# Altium schematic sheet Interface_Accelerometer_1.SchDoc
size A4
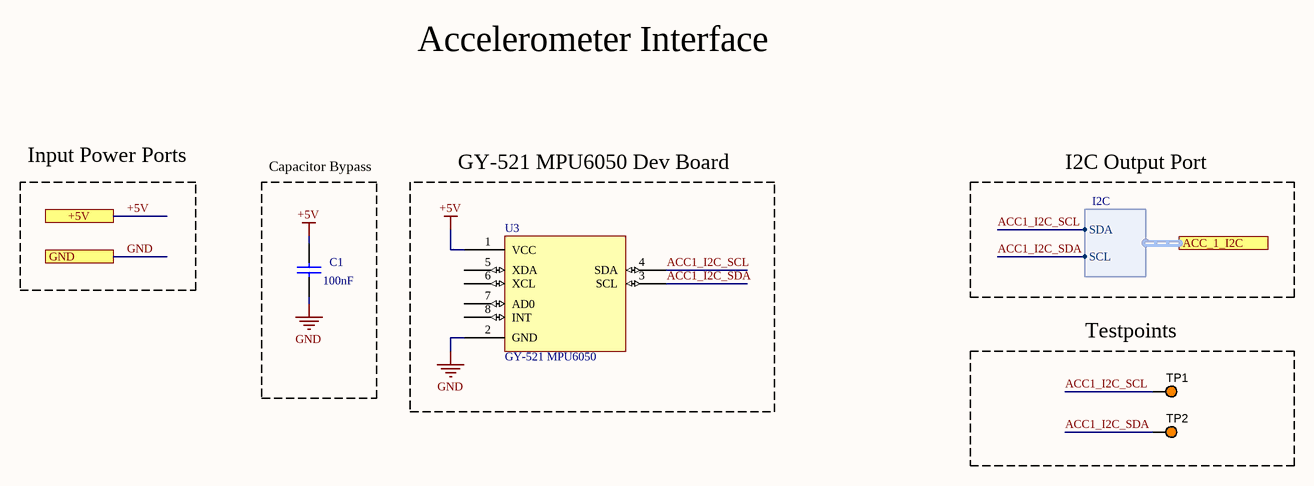
[diagram p0: Interface_Accelerometer_1.SchDoc]

## Parts
C1  100nF  [CAP200]
TP1  5003  [KSTN-5003]  (value not drawn)
TP2  5003  [KSTN-5003]  (value not drawn)
U3  GY-521 MPU6050  [GY-521 MPU6050]

## Blocks framed on the sheet
Capacitor Bypass: C1
GY-521 MPU6050 Dev Board: U3
Testpoints: TP1 TP2

## Ports
+5V, ACC_1_I2C (harness I2C), GND

## Harnesses
I2C: SDA, SCL

## Nets
+5V: C1.1 U3.1(VCC) ; port +5V
GND: C1.2 U3.2(GND) ; port GND
ACC1_I2C_SCL: TP1.1 U3.4(SDA) ; port ACC_1_I2C.SDA
ACC1_I2C_SDA: TP2.1 U3.3(SCL) ; port ACC_1_I2C.SCL

Not connected (* = marked no-connect by the designer): U3 5(XDA) 6(XCL) 7(AD0) 8(INT)

## Notes on the sheet
- Accelerometer Interface
- Input Power Ports
- I2C Output Port

## Library data of the parts
C1 = CAP
TP1 TP2 = CMP-002-00037-2: Test Point, Orange, Height 4.6 mm, Tail Length 3 mm, 1-Pin THD, RoHS; Manufacturer: Keystone; Colour: Orange; Packaging: Bulk; Package Description: 1-Pin Through Hole Device, Dia 2.54 mm; Pins: 1; Package Reference: 5003; Datasheet Version: Jun-15; Case/Package: 5003; Mounting Technology: TH; Connector Type: TestPoint; Diameter: 2.54mm; Contact Material: Bronze; Datasheet URL: http://keyelco.com/userAssets/file/M65p56.pdf; Manufacturer URL: http://www.keyelco.com/; Package Quantity: 10; Contact Plating: Tin; RoHS Compliant: True
U3 = GY-521 MPU6050: 3 Axis Accelerometer Gyroscope Module 6 DOF 6-Axis Acceleration Sensor Gyroscope Sensor Module 16 Bit AD Converter Data Output IIC for Arduino